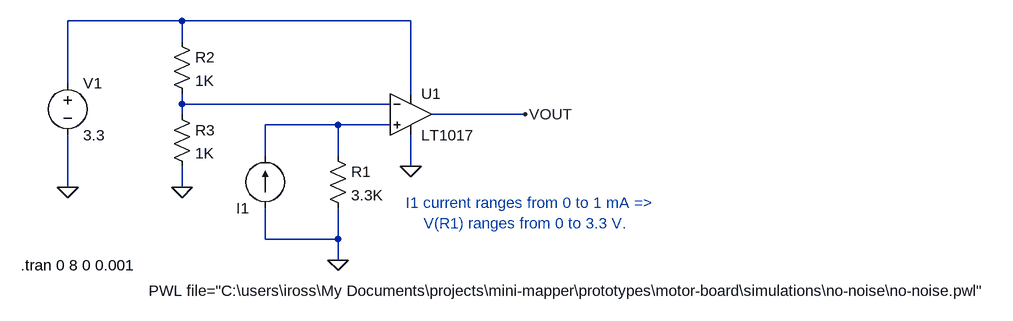
[diagram p0: schematic no-noise.asc]
no-noise.asc, the LTspice schematic file:
Version 4
SHEET 1 1556 680
WIRE 48 -80 -128 -80
WIRE 400 -80 48 -80
WIRE 48 -48 48 -80
WIRE -128 16 -128 -80
WIRE 400 32 400 -80
WIRE 48 48 48 32
WIRE 368 48 48 48
WIRE 48 64 48 48
WIRE 576 64 432 64
WIRE 288 80 176 80
WIRE 368 80 288 80
WIRE 176 128 176 80
WIRE 288 128 288 80
WIRE 400 144 400 96
WIRE -128 176 -128 96
WIRE 48 176 48 144
WIRE 176 256 176 208
WIRE 288 256 288 208
WIRE 288 256 176 256
WIRE 288 288 288 256
FLAG 288 288 0
FLAG 400 144 0
FLAG -128 176 0
FLAG 48 176 0
FLAG 576 64 VOUT
SYMBOL current 176 208 R180
WINDOW 3 -1119 -127 Left 2
WINDOW 123 0 0 Left 0
WINDOW 39 0 0 Left 0
SYMATTR Value PWL file="C:\users\iross\My Documents\projects\mini-mapper\prototypes\motor-board\simulations\no-noise\no-noise.pwl"
SYMATTR InstName I1
SYMBOL res 272 112 R0
SYMATTR InstName R1
SYMATTR Value 3.3K
SYMBOL Comparators\\LT1017 400 64 R0
SYMATTR InstName U1
SYMBOL voltage -128 0 R0
WINDOW 123 0 0 Left 0
WINDOW 39 0 0 Left 0
SYMATTR InstName V1
SYMATTR Value 3.3
SYMBOL res 32 -64 R0
SYMATTR InstName R2
SYMATTR Value 1K
SYMBOL res 32 48 R0
SYMATTR InstName R3
SYMATTR Value 1K
TEXT -200 296 Left 2 !.tran 0 8 0 0.001
TEXT 392 200 Left 2 ;I1 current ranges from 0 to 1 mA =>\n    V(R1) ranges from 0 to 3.3 V.

The netlist it stands for:
* no-noise.asc
I1 0 N003 PWL file="C:\users\iross\My Documents\projects\mini-mapper\prototypes\motor-board\simulations\no-noise\no-noise.pwl"
R1 N003 0 3.3K
XU1 N003 N002 N001 0 VOUT LT1017  ; pins In+ In- V+ V- OUT
V1 N001 0 3.3
R2 N001 N002 1K
R3 N002 0 1K
.tran 0 8 0 0.001
* I1 current ranges from 0 to 1 mA =>
*     V(R1) ranges from 0 to 3.3 V.
.backanno
.end